# Altium schematic sheet Amplifier.SchDoc
size A
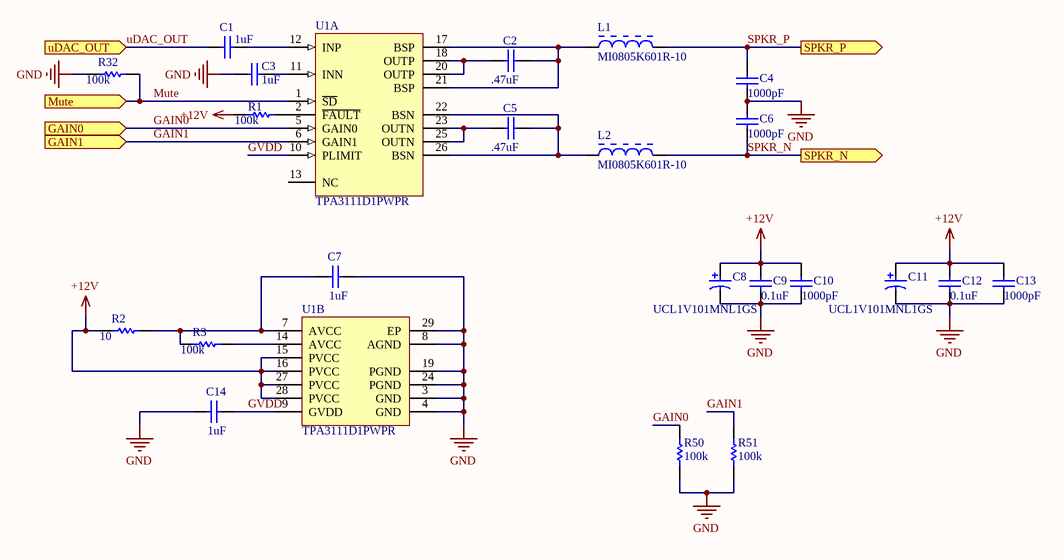
[diagram p0: Amplifier.SchDoc]

## Parts
C1  1uF  [CAPC0603(1608)100_L]
C2  .47uF  [CAPC0805(2012)110_N]
C3  1uF  [CAPC0603(1608)100_L]
C4  1000pF  [CAPC0805(2012)145_L]
C5  .47uF  [CAPC0805(2012)110_N]
C6  1000pF  [CAPC0805(2012)145_L]
C7  1uF  [CAPC0603(1608)100_L]
C8  UCL1V101MNL1GS  [NIC-UCL1V101MNL1GS_L]
C9  0.1uF  [CAPC0805(2012)145_L]
C10  1000pF  [CAPC0805(2012)145_L]
C11  UCL1V101MNL1GS  [NIC-UCL1V101MNL1GS_L]
C12  0.1uF  [CAPC0805(2012)145_L]
C13  1000pF  [CAPC0805(2012)145_L]
C14  1uF  [CAPC0603(1608)100_L]
L1  MI0805K601R-10  [LIRD-MI0805K601R-10-2_V]
L2  MI0805K601R-10  [LIRD-MI0805K601R-10-2_V]
R1  100K  [RESC0805(2012)_L]
R2  value 10  [RESC0805(2012)_L]  (hidden comment: 10R)
R3  100k  [RESC0805(2012)_L]
R32  100K  [RESC0805(2012)_L]
R50  100K  [RESC0805(2012)_L]
R51  100K  [RESC0805(2012)_L]
U1  TPA3111D1PWPR  [TI-PWP28-5720X1950TP_Q]  (parts A,B of 2)

## Ports
GAIN0 (in), GAIN1 (in), Mute (in), SPKR_N (out), SPKR_P (out), uDAC_OUT (in)

## Nets
+12V: C8.1 C9.2 C10.2 C11.1 C12.2 C13.2 R1.1 R2.1 U1.15(PVCC) U1.16(PVCC) U1.27(PVCC) U1.28(PVCC)
GND: C3.1 C4.1 C6.2 C7.2 C8.2 C9.1 C10.1 C11.2 C12.1 C13.1 C14.1 R32.1 R50.1 R51.1 U1.3(GND) U1.4(GND) U1.8(AGND) U1.19(PGND) U1.24(PGND) U1.29(EP)
GAIN0: R50.2 U1.5(GAIN0) ; port GAIN0
GAIN1: R51.2 U1.6(GAIN1) ; port GAIN1
GVDD: C14.2 U1.9(GVDD) U1.10(PLIMIT)
Mute: R32.2 U1.1(~{SD}) ; port Mute
SPKR_N: C6.1 L2.2 ; port SPKR_N
SPKR_P: C4.2 L1.2 ; port SPKR_P
uDAC_OUT: C1.1 ; port uDAC_OUT
NetC1_2: C1.2 U1.12(INP)
NetC2_1: C2.1 U1.18(OUTP) U1.20(OUTP)
NetC2_2: C2.2 L1.1 U1.17(BSP) U1.21(BSP)
NetC3_2: C3.2 U1.11(INN)
NetC5_1: C5.1 U1.23(OUTN) U1.25(OUTN)
NetC5_2: C5.2 L2.1 U1.22(BSN) U1.26(BSN)
NetC7_1: C7.1 R2.2 R3.1 U1.7(AVCC)
NetR1_2: R1.2 U1.2(~{FAULT})
NetR3_2: R3.2 U1.14(AVCC)

Not connected (* = marked no-connect by the designer): U1 13(NC)

## Library data of the parts
C1 C3 C7 C14 = CMP-1035-02740-1: CAP 1uF 25V ±10% 0603 (1608 Metric) Thickness 1mm SMD; Tolerance: Â±10%; Case-Metric: 1608; Case-EIA: 0603; Technology: SMT; Rated Voltage: 25 V; Max Thickness: 1 mm; Value: 1uF
C2 C5 = CMP-1036-04655-1: CAP 470nF 50V ±20% 0805 (2012 Metric) Thickness 1.1mm SMD; Case-Metric: 2012; Case-EIA: 0805; Tolerance: Â±20%; Max Thickness: 1.1 mm; Value: 470nF; Technology: SMT; Rated Voltage: 50 V
C4 C6 C9 C10 C12 C13 = CMP-1590-00003-1: 0805 (2012 Metric) Chip Capacitor; Case-EIA: 0805; Case-Metric: 2012; PackageReference: CAPC0805(2012)145
C8 C11 = CMP-2000-07344-1: Aluminum Electrolytic Capacitor, 100 uF, 35 V, 20%, -55 to 105 degC, 2-Pin SMD, RoHS, Tape and Reel; Manufacturer: Nichicon; Capacitance: 100uF; Dissipation Factor DF: 0.12; Case Diameter: 8mm; Ripple Current: 850mA; Type: AluminumElectrolyticCapacitors,ChipType,LowImpedance; Case Height: 8.3mm; Leakage Current: 3uA; Voltage Rating DC: 35V; Load Life: 2000h; Case Length: 10mm; Series: CL; Minimum Operating Temperature: -55C; Datasheet URL: http://datasheet.octopart.com/UCL1V101MNL1GS-Nichicon-datasheet-41194108.pdf; Manufacturer URL: http://www.nichicon.co.jp/english/; Maximum Operating Temperature: +105C; Package Reference: UCL1V101MNL1GS; Operating Temperature Range: -55Cto+105C; Brand: Nichicon; Package Description: 2-Pin Surface Mount Device, Body 8.3 x 8.3 mm, Height 10.8 mm; RoHS: Details; Voltage Rating: 35V; Dimensions: 8mmDia.x10mmLx8.3mmH; Termination Style: SMD/SMT; Datasheet Version: 01/2015; Packaging: Reel; Mounting Technology: SurfaceMount; Product Category: AluminumElectrolyticCapacitors-SMD; Factory Pack Quantity: 500; Product: LowImpedanceElectrolyticCapacitors; Tolerance: 20%
L1 L2 = CMP-2000-05196-1: Chip Bead for Power Filtering, 1500 mA, 600 Ohm, -40 to 125 degC, 0805 (2012 Metric), RoHS, Tape and Reel; Manufacturer: Laird; Filter Type: PowerLine; Current Rating (Max): 1.5A; Catalog Drawings: (HI,HZ,LI,MI)0805Series_1.10mmMax.Height; Impedance @ Frequency: 600Ohm@100MHz; Number of Lines: 1; DC Resistance (DCR) (Max): 100mOhm; Other Names: 240-2390-1; Kits: 240-2227-ND-KITEMIFERRITEBEADCHIPSMD; Online Catalog: MISeries; Standard Package: 1; Datasheet Version: Rev. A, 01/2004; Height (Max): 0.043"(1.10mm); Category: Filters; Operating Temperature: -40degC~125degC; Package Description: 2-Pin Surface Mount Device, Body 2 x 1.25 mm; Package / Case: 0805(2012Metric); Package Reference: MI0805K601R-10-2; Packaging: CutTape(CT); Ratings: -; Mounting Type: SurfaceMount; Datasheet URL: https://datasheet.ciiva.com/3082/mi0805k601r-10-a-vp-3082219.pdf; Size / Dimension: 0.079"Lx0.049"W(2.00mmx1.25mm); Family: FerriteBeadsandChips; Manufacturer URL: https://www.lairdtech.com; Series: MI
R1-R3 R32 R50 R51 = CMP-1591-00002-1: 0805 (2012 Metric) Chip Resistor; Case-EIA: 0805; Case-Metric: 2012; PackageReference: RESC0805(2012)
  R1 R3 R32 R50 R51: Value: 100k
U1 = CMP-0994-00250-1: 10 W Mono Class-D Audio Power Amplifier with SpeakerGuard(TM), -40 to 85 degC, 28-pin SOP (PWP28), Green (RoHS & no Sb/Br); Manufacturer: Texas Instruments; Input Type: Analog; Max. Number of Speaker Outputs: 1; Analog Supply Max [V]: 26; Analog Supply Min [V]: 8; SubFamily: Mid/High-Power Amplifier; ComponentLink1URL: http://www.ti.com/; DatasheetVersion: SLOS618C; ComponentLink2URL: http://www.ti.com/general/docs/lit/getliterature.tsp?genericPartNumber=TPA3111D1&fileType=pdf; ComponentLink1Description: Manufacturer URL; Code_JEDEC: MO-153; ComponentLink2Description: Datasheet; Eco-Plan: Green (RoHS & no Sb/Br); ComponentLink3URL: http://www.ti.com/litv/pdf/mpds373; PackageDescription: 28-Pin Plastic Small Outline, Body 4.4 x 9.7 mm, Pitch 0.65 mm; Power Stage Supply Min(V): 8; PackageVersion: 4073225-6/I, 05/2011; Mounting Technology: Surface Mount; PartNumber: TPA3111D1PWPR; PackageReference: PWP28-5720X1950TP; ComponentLink3Description: Package Specification